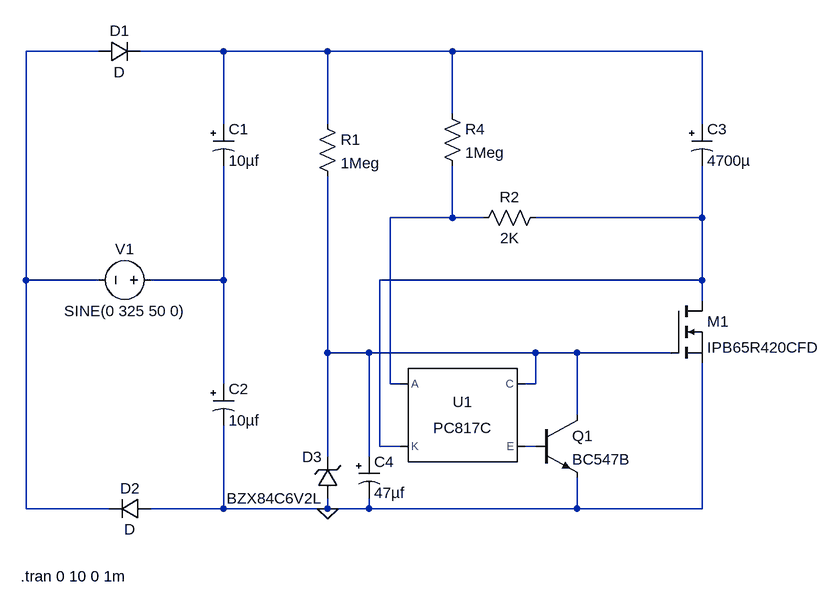
[diagram p0: schematic fullwave-doubler-1V02-02.asc]
fullwave-doubler-1V02-02.asc, the LTspice schematic file:
Version 4
SHEET 1 996 872
WIRE -192 -80 -304 -80
WIRE 0 -80 -128 -80
WIRE 160 -80 0 -80
WIRE 352 -80 160 -80
WIRE 736 -80 352 -80
WIRE 352 16 352 -80
WIRE 0 32 0 -80
WIRE 160 32 160 -80
WIRE 736 32 736 -80
WIRE 352 176 352 96
WIRE 352 176 256 176
WIRE 400 176 352 176
WIRE 736 176 736 96
WIRE 736 176 480 176
WIRE -304 272 -304 -80
WIRE -192 272 -304 272
WIRE 0 272 0 96
WIRE 0 272 -112 272
WIRE 736 272 736 176
WIRE 736 272 240 272
WIRE 736 304 736 272
WIRE 160 384 160 112
WIRE 224 384 160 384
WIRE 480 384 224 384
WIRE 544 384 480 384
WIRE 688 384 544 384
WIRE 0 432 0 272
WIRE 256 432 256 176
WIRE 272 432 256 432
WIRE 480 432 480 384
WIRE 480 432 464 432
WIRE 544 480 544 384
WIRE 240 528 240 272
WIRE 272 528 240 528
WIRE 480 528 464 528
WIRE 160 544 160 384
WIRE 224 544 224 384
WIRE -304 624 -304 272
WIRE -176 624 -304 624
WIRE 0 624 0 496
WIRE 0 624 -112 624
WIRE 160 624 160 608
WIRE 160 624 0 624
WIRE 224 624 224 608
WIRE 224 624 160 624
WIRE 544 624 544 576
WIRE 544 624 224 624
WIRE 736 624 736 400
WIRE 736 624 544 624
FLAG 160 624 0
SYMBOL voltage -96 272 R90
WINDOW 0 -32 56 VBottom 2
WINDOW 3 32 56 VTop 2
WINDOW 123 0 0 Left 2
WINDOW 39 0 0 Left 2
SYMATTR InstName V1
SYMATTR Value SINE(0 325 50 0)
SYMBOL polcap -16 32 R0
SYMATTR InstName C1
SYMATTR Value 10µf
SYMATTR Description Capacitor
SYMATTR Type cap
SYMATTR SpiceLine V=6.3 Irms=34m Rser=1.3 Lser=0
SYMBOL nmos 688 304 R0
SYMATTR InstName M1
SYMATTR Value IPB65R420CFD
SYMBOL diode -192 -64 R270
WINDOW 0 32 32 VTop 2
WINDOW 3 0 32 VBottom 2
SYMATTR InstName D1
SYMBOL diode -112 608 R90
WINDOW 0 0 32 VBottom 2
WINDOW 3 32 32 VTop 2
SYMATTR InstName D2
SYMBOL polcap -16 432 R0
SYMATTR InstName C2
SYMATTR Value 10µf
SYMATTR Description Capacitor
SYMATTR Type cap
SYMATTR SpiceLine V=6.3 Irms=34m Rser=1.3 Lser=0
SYMBOL polcap 720 32 R0
SYMATTR InstName C3
SYMATTR Value 4700µ
SYMATTR Description Capacitor
SYMATTR Type cap
SYMATTR SpiceLine V=6.3 Irms=34m Rser=100m Lser=0
SYMBOL polcap 208 544 R0
SYMATTR InstName C4
SYMATTR Value 47µf
SYMATTR Description Capacitor
SYMATTR Type cap
SYMATTR SpiceLine V=6.3 Irms=34m Rser=2.4 Lser=0
SYMBOL res 144 16 R0
SYMATTR InstName R1
SYMATTR Value 1Meg
SYMBOL zener 176 608 R180
WINDOW 0 24 64 Left 2
WINDOW 3 24 0 Left 2
SYMATTR InstName D3
SYMATTR Value BZX84C6V2L
SYMATTR Description Diode
SYMATTR Type diode
SYMBOL res 336 0 R0
SYMATTR InstName R4
SYMATTR Value 1Meg
SYMBOL res 496 160 R90
WINDOW 0 0 56 VBottom 2
WINDOW 3 32 56 VTop 2
SYMATTR InstName R2
SYMATTR Value 2K
SYMBOL Optos\\PC817C 368 480 R0
SYMATTR InstName U1
SYMBOL npn 480 480 R0
SYMATTR InstName Q1
SYMATTR Value BC547B
TEXT -312 728 Left 2 !.tran 0 10 0 1m

The netlist it stands for:
* fullwave-doubler-1V02-02.asc
V1 N005 N001 SINE(0 325 50 0)
C1 N002 N005 10µf V=6.3 Irms=34m Rser=1.3 Lser=0
M1 N004 N006 0 0 IPB65R420CFD
D1 N001 N002 D
D2 0 N001 D
C2 N005 0 10µf V=6.3 Irms=34m Rser=1.3 Lser=0
C3 N002 N004 4700µ V=6.3 Irms=34m Rser=100m Lser=0
C4 N006 0 47µf V=6.3 Irms=34m Rser=2.4 Lser=0
R1 N002 N006 1Meg
D3 0 N006 BZX84C6V2L
R4 N002 N003 1Meg
R2 N004 N003 2K
XU1 N003 N004 N006 N007 PC817 Igain=2.3m  ; PC817C, pins A K C E
Q1 N006 N007 0 0 BC547B
.model D D
.lib standard.dio
.model NPN NPN
.model PNP PNP
.lib standard.bjt
.model NMOS NMOS
.model PMOS PMOS
.lib standard.mos
.tran 0 10 0 1m
.lib PC817.sub
.backanno
.end